# Altium schematic sheet 03_BANK_1_2.SchDoc
size OrCAD B
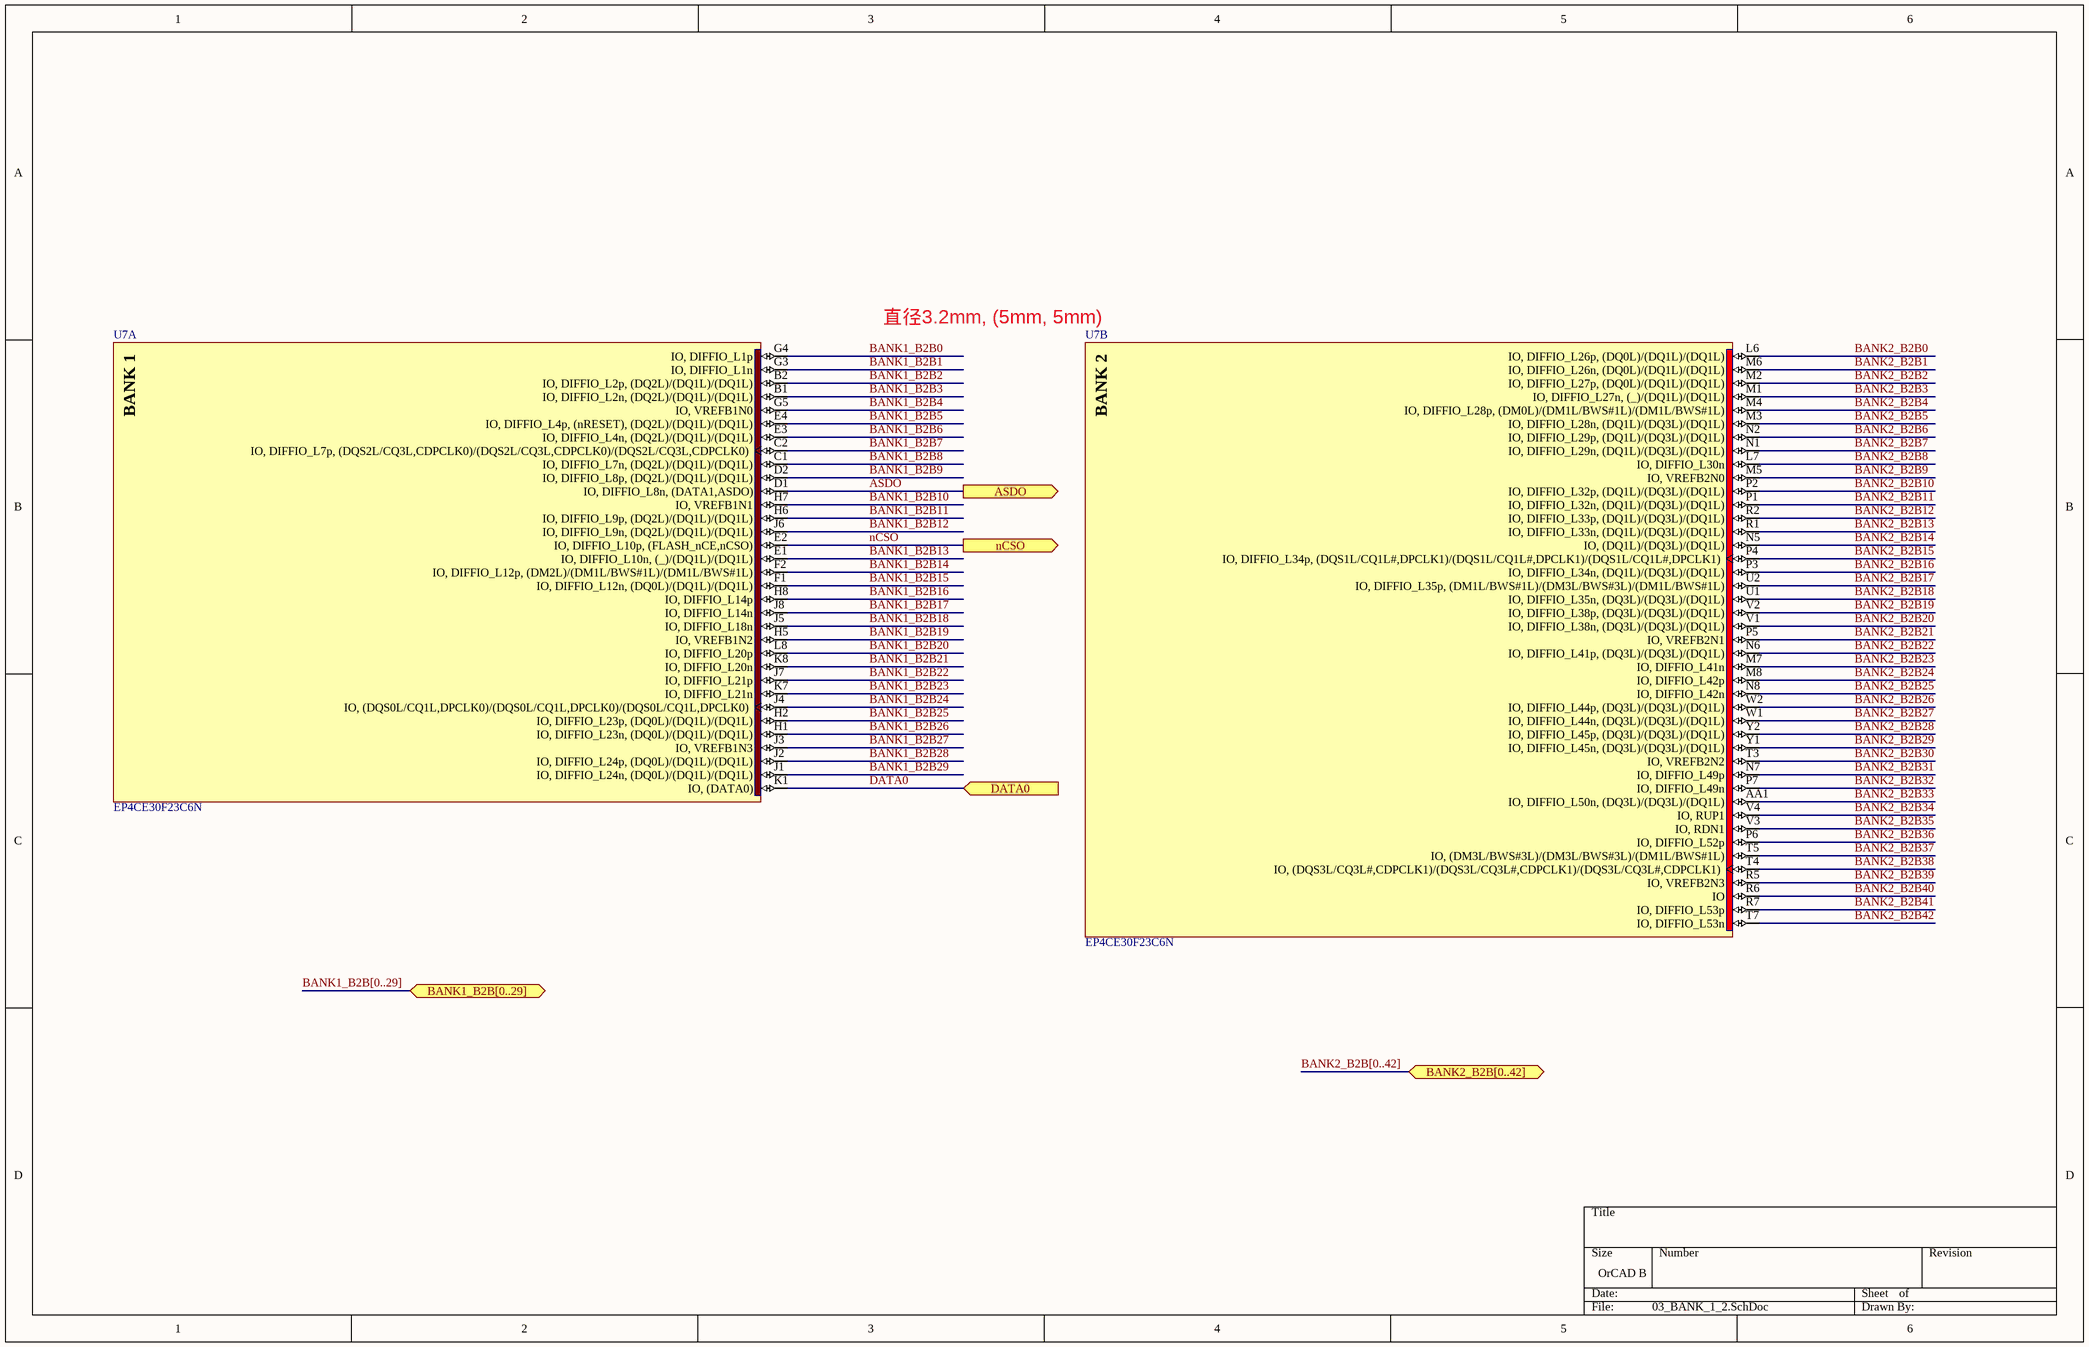
[diagram p0: 03_BANK_1_2.SchDoc]

## Parts
U7  EP4CE30F23C6N  [FBGA484_EP4CE30F23C6N]  (parts A,B of 13)

## Ports
ASDO (out), BANK1_B2B[0..29] (bidir), BANK2_B2B[0..42] (bidir), DATA0 (in), nCSO (out)

## Nets
ASDO: U7.D1(IO,_DIFFIO_L8n,_(DATA1,ASDO)) ; port ASDO
BANK1_B2B0: U7.G4(IO,_DIFFIO_L1p)
BANK1_B2B1: U7.G3(IO,_DIFFIO_L1n)
BANK1_B2B2: U7.B2(IO,_DIFFIO_L2p,_(DQ2L)/(DQ1L)/(DQ1L))
BANK1_B2B3: U7.B1(IO,_DIFFIO_L2n,_(DQ2L)/(DQ1L)/(DQ1L))
BANK1_B2B4: U7.G5(IO,_VREFB1N0)
BANK1_B2B5: U7.E4(IO,_DIFFIO_L4p,_(nRESET),_(DQ2L)/(DQ1L)/(DQ1L))
BANK1_B2B6: U7.E3(IO,_DIFFIO_L4n,_(DQ2L)/(DQ1L)/(DQ1L))
BANK1_B2B7: U7.C2(IO,_DIFFIO_L7p,_(DQS2L/CQ3L,CDPCLK0)/(DQS2L/CQ3L,CDPCLK0)/(DQS2L/CQ3L,CDPCLK0))
BANK1_B2B8: U7.C1(IO,_DIFFIO_L7n,_(DQ2L)/(DQ1L)/(DQ1L))
BANK1_B2B9: U7.D2(IO,_DIFFIO_L8p,_(DQ2L)/(DQ1L)/(DQ1L))
BANK1_B2B10: U7.H7(IO,_VREFB1N1)
BANK1_B2B11: U7.H6(IO,_DIFFIO_L9p,_(DQ2L)/(DQ1L)/(DQ1L))
BANK1_B2B12: U7.J6(IO,_DIFFIO_L9n,_(DQ2L)/(DQ1L)/(DQ1L))
BANK1_B2B13: U7.E1(IO,_DIFFIO_L10n,_(_)/(DQ1L)/(DQ1L))
BANK1_B2B14: U7.F2(IO,_DIFFIO_L12p,_(DM2L)/(DM1L/BWS#1L)/(DM1L/BWS#1L))
BANK1_B2B15: U7.F1(IO,_DIFFIO_L12n,_(DQ0L)/(DQ1L)/(DQ1L))
BANK1_B2B16: U7.H8(IO,_DIFFIO_L14p)
BANK1_B2B17: U7.J8(IO,_DIFFIO_L14n)
BANK1_B2B18: U7.J5(IO,_DIFFIO_L18n)
BANK1_B2B19: U7.H5(IO,_VREFB1N2)
BANK1_B2B20: U7.L8(IO,_DIFFIO_L20p)
BANK1_B2B21: U7.K8(IO,_DIFFIO_L20n)
BANK1_B2B22: U7.J7(IO,_DIFFIO_L21p)
BANK1_B2B23: U7.K7(IO,_DIFFIO_L21n)
BANK1_B2B24: U7.J4(IO,_(DQS0L/CQ1L,DPCLK0)/(DQS0L/CQ1L,DPCLK0)/(DQS0L/CQ1L,DPCLK0))
BANK1_B2B25: U7.H2(IO,_DIFFIO_L23p,_(DQ0L)/(DQ1L)/(DQ1L))
BANK1_B2B26: U7.H1(IO,_DIFFIO_L23n,_(DQ0L)/(DQ1L)/(DQ1L))
BANK1_B2B27: U7.J3(IO,_VREFB1N3)
BANK1_B2B28: U7.J2(IO,_DIFFIO_L24p,_(DQ0L)/(DQ1L)/(DQ1L))
BANK1_B2B29: U7.J1(IO,_DIFFIO_L24n,_(DQ0L)/(DQ1L)/(DQ1L))
BANK2_B2B0: U7.L6(IO,_DIFFIO_L26p,_(DQ0L)/(DQ1L)/(DQ1L))
BANK2_B2B1: U7.M6(IO,_DIFFIO_L26n,_(DQ0L)/(DQ1L)/(DQ1L))
BANK2_B2B2: U7.M2(IO,_DIFFIO_L27p,_(DQ0L)/(DQ1L)/(DQ1L))
BANK2_B2B3: U7.M1(IO,_DIFFIO_L27n,_(_)/(DQ1L)/(DQ1L))
BANK2_B2B4: U7.M4(IO,_DIFFIO_L28p,_(DM0L)/(DM1L/BWS#1L)/(DM1L/BWS#1L))
BANK2_B2B5: U7.M3(IO,_DIFFIO_L28n,_(DQ1L)/(DQ3L)/(DQ1L))
BANK2_B2B6: U7.N2(IO,_DIFFIO_L29p,_(DQ1L)/(DQ3L)/(DQ1L))
BANK2_B2B7: U7.N1(IO,_DIFFIO_L29n,_(DQ1L)/(DQ3L)/(DQ1L))
BANK2_B2B8: U7.L7(IO,_DIFFIO_L30n)
BANK2_B2B9: U7.M5(IO,_VREFB2N0)
BANK2_B2B10: U7.P2(IO,_DIFFIO_L32p,_(DQ1L)/(DQ3L)/(DQ1L))
BANK2_B2B11: U7.P1(IO,_DIFFIO_L32n,_(DQ1L)/(DQ3L)/(DQ1L))
BANK2_B2B12: U7.R2(IO,_DIFFIO_L33p,_(DQ1L)/(DQ3L)/(DQ1L))
BANK2_B2B13: U7.R1(IO,_DIFFIO_L33n,_(DQ1L)/(DQ3L)/(DQ1L))
BANK2_B2B14: U7.N5(IO,_(DQ1L)/(DQ3L)/(DQ1L))
BANK2_B2B15: U7.P4(IO,_DIFFIO_L34p,_(DQS1L/CQ1L#,DPCLK1)/(DQS1L/CQ1L#,DPCLK1)/(DQS1L/CQ1L#,DPCLK1))
BANK2_B2B16: U7.P3(IO,_DIFFIO_L34n,_(DQ1L)/(DQ3L)/(DQ1L))
BANK2_B2B17: U7.U2(IO,_DIFFIO_L35p,_(DM1L/BWS#1L)/(DM3L/BWS#3L)/(DM1L/BWS#1L))
BANK2_B2B18: U7.U1(IO,_DIFFIO_L35n,_(DQ3L)/(DQ3L)/(DQ1L))
BANK2_B2B19: U7.V2(IO,_DIFFIO_L38p,_(DQ3L)/(DQ3L)/(DQ1L))
BANK2_B2B20: U7.V1(IO,_DIFFIO_L38n,_(DQ3L)/(DQ3L)/(DQ1L))
BANK2_B2B21: U7.P5(IO,_VREFB2N1)
BANK2_B2B22: U7.N6(IO,_DIFFIO_L41p,_(DQ3L)/(DQ3L)/(DQ1L))
BANK2_B2B23: U7.M7(IO,_DIFFIO_L41n)
BANK2_B2B24: U7.M8(IO,_DIFFIO_L42p)
BANK2_B2B25: U7.N8(IO,_DIFFIO_L42n)
BANK2_B2B26: U7.W2(IO,_DIFFIO_L44p,_(DQ3L)/(DQ3L)/(DQ1L))
BANK2_B2B27: U7.W1(IO,_DIFFIO_L44n,_(DQ3L)/(DQ3L)/(DQ1L))
BANK2_B2B28: U7.Y2(IO,_DIFFIO_L45p,_(DQ3L)/(DQ3L)/(DQ1L))
BANK2_B2B29: U7.Y1(IO,_DIFFIO_L45n,_(DQ3L)/(DQ3L)/(DQ1L))
BANK2_B2B30: U7.T3(IO,_VREFB2N2)
BANK2_B2B31: U7.N7(IO,_DIFFIO_L49p)
BANK2_B2B32: U7.P7(IO,_DIFFIO_L49n)
BANK2_B2B33: U7.AA1(IO,_DIFFIO_L50n,_(DQ3L)/(DQ3L)/(DQ1L))
BANK2_B2B34: U7.V4(IO,_RUP1)
BANK2_B2B35: U7.V3(IO,_RDN1)
BANK2_B2B36: U7.P6(IO,_DIFFIO_L52p)
BANK2_B2B37: U7.T5(IO,_(DM3L/BWS#3L)/(DM3L/BWS#3L)/(DM1L/BWS#1L))
BANK2_B2B38: U7.T4(IO,_(DQS3L/CQ3L#,CDPCLK1)/(DQS3L/CQ3L#,CDPCLK1)/(DQS3L/CQ3L#,CDPCLK1))
BANK2_B2B39: U7.R5(IO,_VREFB2N3)
BANK2_B2B40: U7.R6(IO)
BANK2_B2B41: U7.R7(IO,_DIFFIO_L53p)
BANK2_B2B42: U7.T7(IO,_DIFFIO_L53n)
DATA0: U7.K1(IO,_(DATA0)) ; port DATA0
nCSO: U7.E2(IO,_DIFFIO_L10p,_(FLASH_nCE,nCSO)) ; port nCSO

## Buses and harness runs
bus BANK1_B2B[0..29] = port BANK1_B2B[0..29]
bus BANK2_B2B[0..42] = port BANK2_B2B[0..42]

## Notes on the sheet
- 直径3.2mm, (5mm, 5mm)
- (in symbol EP4CE30F23C6N, part A) BANK 1
- (in symbol EP4CE30F23C6N, part B) BANK 2

## Library data of the parts
U7 = EP4CE30F23C6N: IC,FPGA,28848 LEs,Speed-6,FBGA484; Manufacturer1: ALTERA; PartNumberManufacturer1: EP4CE30F23C6N; UnitPrice: *; PartNumberManufacturer2: *; Manufacturer2: *